# EAGLE design FeederShieldMega (EAGLE 9.6.0)
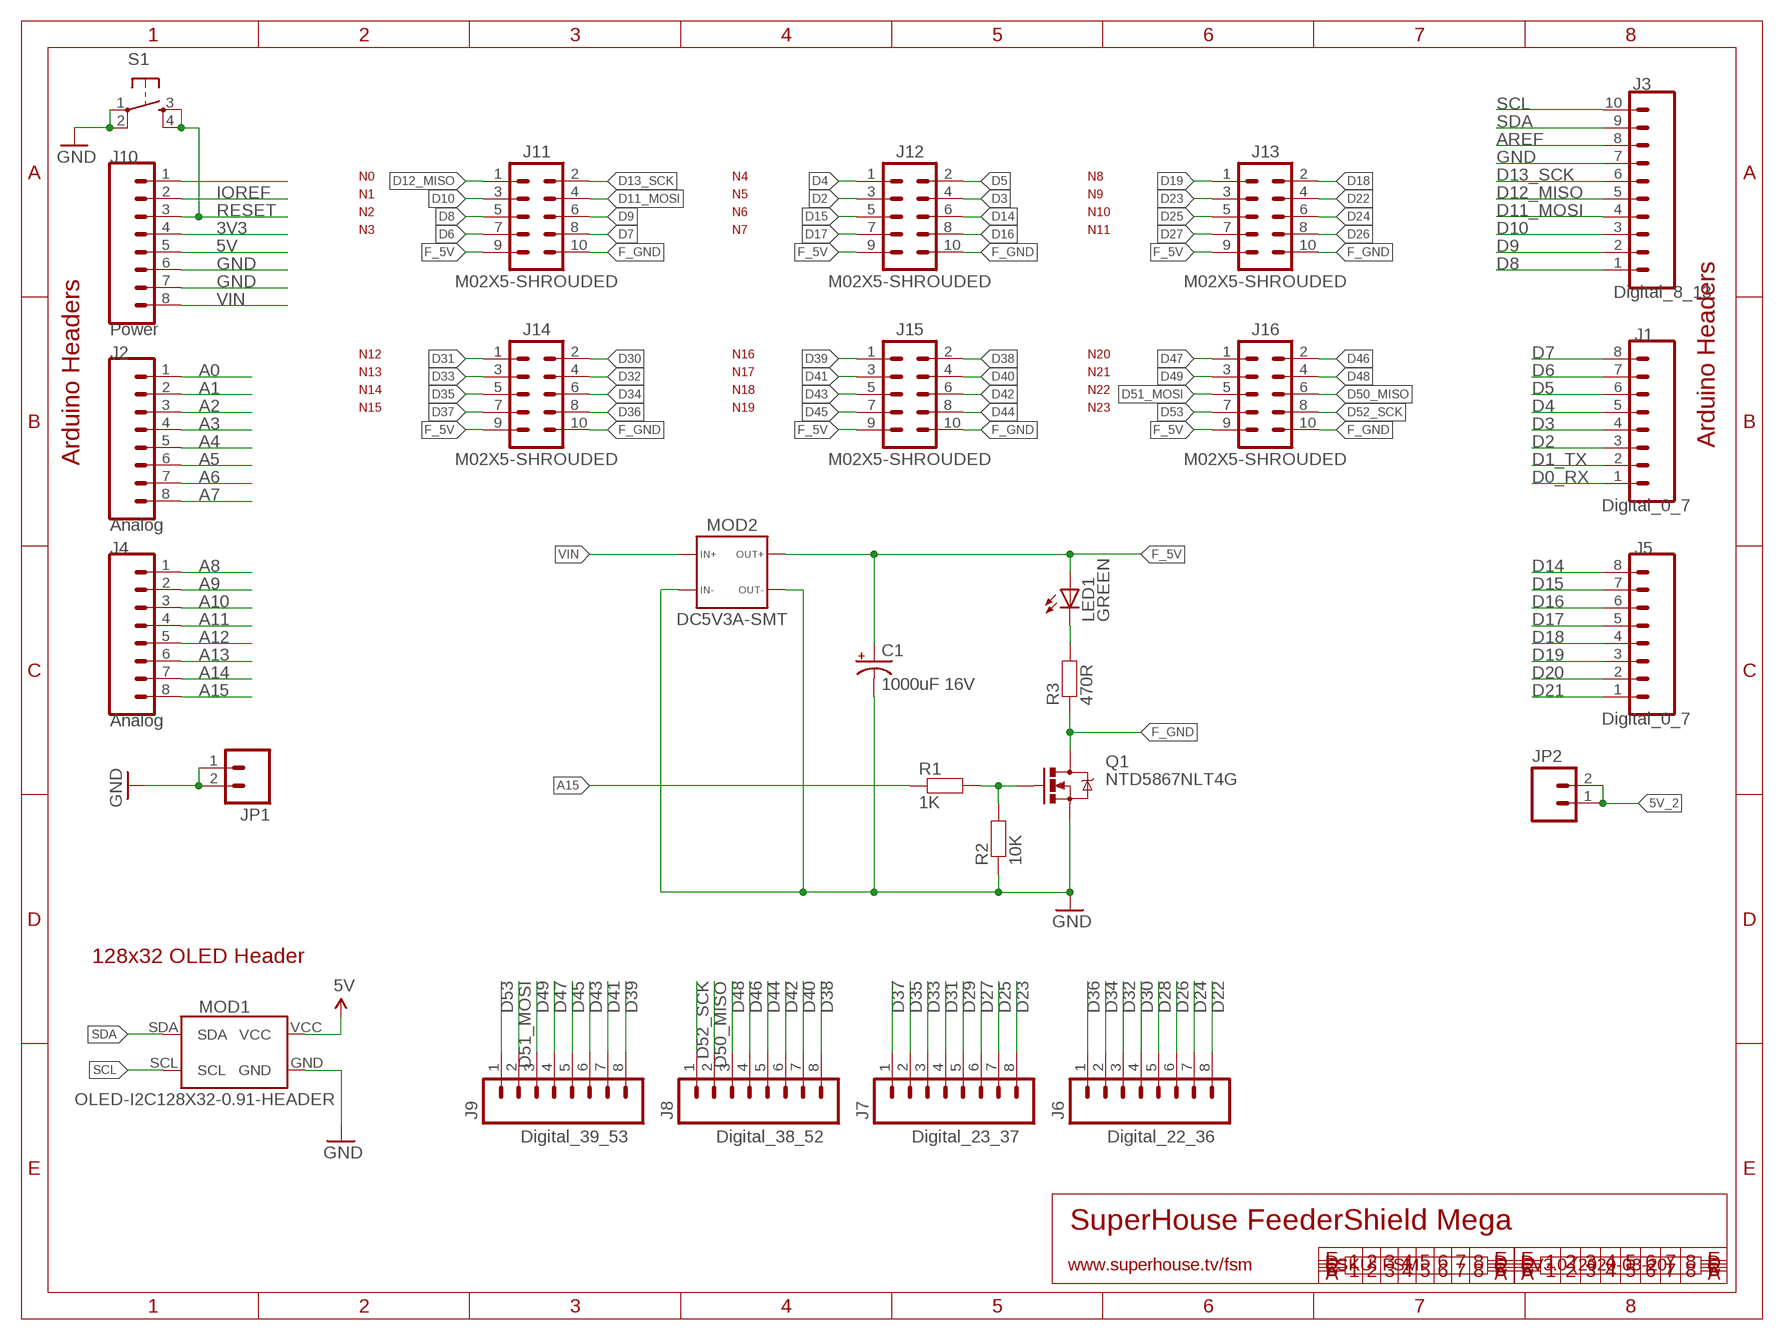
[diagram p0: schematic, sheet 1]

## Parts
C1  1000uF 16V  CAP_POL-5.08-10X18-FLAT  [CPOL-RADIAL-5.08-10X18-FLAT]
J1  Digital_0_7  M08-PIN-BELOW  [1X08-P-BELOW]
J2  Analog  M08-PIN-BELOW  [1X08-P-BELOW]
J3  Digital_8_13  M10-PIN-BELOW  [1X10-P-BELOW]
J4  Analog  M08-PIN-BELOW  [1X08-P-BELOW]
J5  Digital_0_7  M08-PIN-BELOW  [1X08-P-BELOW]
J6  Digital_22_36  M08-PIN-BELOW  [1X08-P-BELOW]
J7  Digital_23_37  M08-PIN-BELOW  [1X08-P-BELOW]
J8  Digital_38_52  M08-PIN-BELOW  [1X08-P-BELOW]
J9  Digital_39_53  M08-PIN-BELOW  [1X08-P-BELOW]
J10  Power  M08-PIN-BELOW  [1X08-P-BELOW]
J11  M02X5-SHROUDED  [2X05-2.54-SHROUDED]
J12  M02X5-SHROUDED  [2X05-2.54-SHROUDED]
J13  M02X5-SHROUDED  [2X05-2.54-SHROUDED]
J14  M02X5-SHROUDED  [2X05-2.54-SHROUDED]
J15  M02X5-SHROUDED  [2X05-2.54-SHROUDED]
J16  M02X5-SHROUDED  [2X05-2.54-SHROUDED]
JP1  M02-PIN-BELOW  [1X02-P-BELOW]
JP2  M02-PIN-BELOW  [1X02-P-BELOW]
LED1  GREEN  LED0603  [LED-0603]
MOD1  OLED-I2C128X32-0.91-HEADER  [OLED-128X32-0.91-HEADER]
MOD2  DC5V3A-SMT  [DC5V3A-SMT]
Q1  NTD5867NLT4G  MOSFET-NCHANNEL-DPAK  [DPACK]
R1  1K  RESISTOR0603  [R0603]
R2  10K  RESISTOR0603  [R0603]
R3  470R  RESISTOR0603  [R0603]
S1  TAC_SWITCH-PTH-6  [TACTILE-PTH-6MM]

## Nets
3V3: J10.4
5V: J10.5 MOD1.VCC
5V_2: JP2.1 JP2.2
A0: J2.1
A1: J2.2
A2: J2.3
A3: J2.4
A4: J2.5
A5: J2.6
A6: J2.7
A7: J2.8
A8: J4.1
A9: J4.2
A10: J4.3
A11: J4.4
A12: J4.5
A13: J4.6
A14: J4.7
A15: J4.8 R1.1
AREF: J3.8
D0_RX: J1.1
D1_TX: J1.2
D2: J1.3 J12.3
D3: J1.4 J12.4
D4: J1.5 J12.1
D5: J1.6 J12.2
D6: J1.7 J11.7
D7: J1.8 J11.8
D8: J3.1 J11.5
D9: J3.2 J11.6
D10: J3.3 J11.3
D11_MOSI: J3.4 J11.4
D12_MISO: J3.5 J11.1
D13_SCK: J3.6 J11.2
D14: J5.8 J12.6
D15: J5.7 J12.5
D16: J5.6 J12.8
D17: J5.5 J12.7
D18: J5.4 J13.2
D19: J5.3 J13.1
D20: J5.2
D21: J5.1
D22: J6.8 J13.4
D23: J7.8 J13.3
D24: J6.7 J13.6
D25: J7.7 J13.5
D26: J6.6 J13.8
D27: J7.6 J13.7
D28: J6.5
D29: J7.5
D30: J6.4 J14.2
D31: J7.4 J14.1
D32: J6.3 J14.4
D33: J7.3 J14.3
D34: J6.2 J14.6
D35: J7.2 J14.5
D36: J6.1 J14.8
D37: J7.1 J14.7
D38: J8.8 J15.2
D39: J9.8 J15.1
D40: J8.7 J15.4
D41: J9.7 J15.3
D42: J8.6 J15.6
D43: J9.6 J15.5
D44: J8.5 J15.8
D45: J9.5 J15.7
D46: J8.4 J16.2
D47: J9.4 J16.1
D48: J8.3 J16.4
D49: J9.3 J16.3
D50_MISO: J8.2 J16.6
D51_MOSI: J9.2 J16.5
D52_SCK: J8.1 J16.8
D53: J9.1 J16.7
F_5V: C1.1(+) J11.9 J12.9 J13.9 J14.9 J15.9 J16.9 LED1.A MOD2.3A MOD2.3B
F_GND: J11.10 J12.10 J13.10 J14.10 J15.10 J16.10 Q1.2(D) R3.1
GND: C1.2(-) J3.7 J10.6 J10.7 JP1.1 JP1.2 MOD1.GND MOD2.1A MOD2.1B MOD2.4A MOD2.4B Q1.3(S) R2.1 S1.1 S1.2
IOREF: J10.2
N$3: Q1.1(G) R1.2 R2.2
N$5: LED1.C R3.2
N$314: J10.1
RESET: J10.3 S1.3 S1.4
SCL: J3.10 MOD1.SCL
SDA: J3.9 MOD1.SDA
VIN: J10.8 MOD2.2A MOD2.2B

## Notes on the sheet
- N0 | N4 | N8
- N1 | N5 | N9
- N2 | N6 | N10
- N3 | N7 | N11
- N12 | N16 | N20
- N13 | N17 | N21
- N14 | N18 | N22
- N15 | N19 | N23
- Arduino Headers
- Arduino Headers
- 128x32 OLED Header
- SuperHouse FeederShield Mega
- www.superhouse.tv/fsm | SKU: FSM | V3.0 (2020-03-20)

## Library data of the parts
C1 = SuperHouse-DiscreteSemi:CAP_POL: Capacitor Polarized These are standard SMD and PTH capacitors. Normally 10uF, 47uF, and 100uF in electrolytic and tantalum varieties. Always verify the external diameter of the through hole cap, it varies with capacity, voltage, and manufacturer. The EIA devices should be standard.
J1 J2 J4-J10 = SuperHouse-Connectors:M08: 8-way header Standard 1x8 header, and screw terminal variations
J3 = SuperHouse-Connectors:M10: 10-way header Standard 1x10 header, and screw terminal variations
J11-J16 = SuperHouse-Connectors:M02X5: M10 header in 2x5 format
JP1 JP2 = SuperHouse-Connectors:M02: 2-way header Standard 1x2 header, and screw terminal variations
LED1 = SuperHouse-LEDs:LED: LEDs Standard schematic elements and footprints for 5mm, 3mm, 1206, and 0603 sized LEDs. 5mm - Spark Fun Electronics SKU : COM-00529 (and others)
MOD1 = SuperHouse-Displays:OLED-I2C: OLED module with SSD1306 I2C driver
MOD2 = SuperHouse-Regulators:DC5V3A: 5V 3A voltage regulator module from AliExpress
Q1 = SuperHouse-DiscreteSemi:MOSFET-NCHANNEL: N-channel MOSFET
R1-R3 = SuperHouse-DiscreteSemi:RESISTOR: Resistor Standard resistors.
S1 = SuperHouse-Switches:TAC_SWITCH: Momentary Switch Tactile switch, normally-open.

## Board
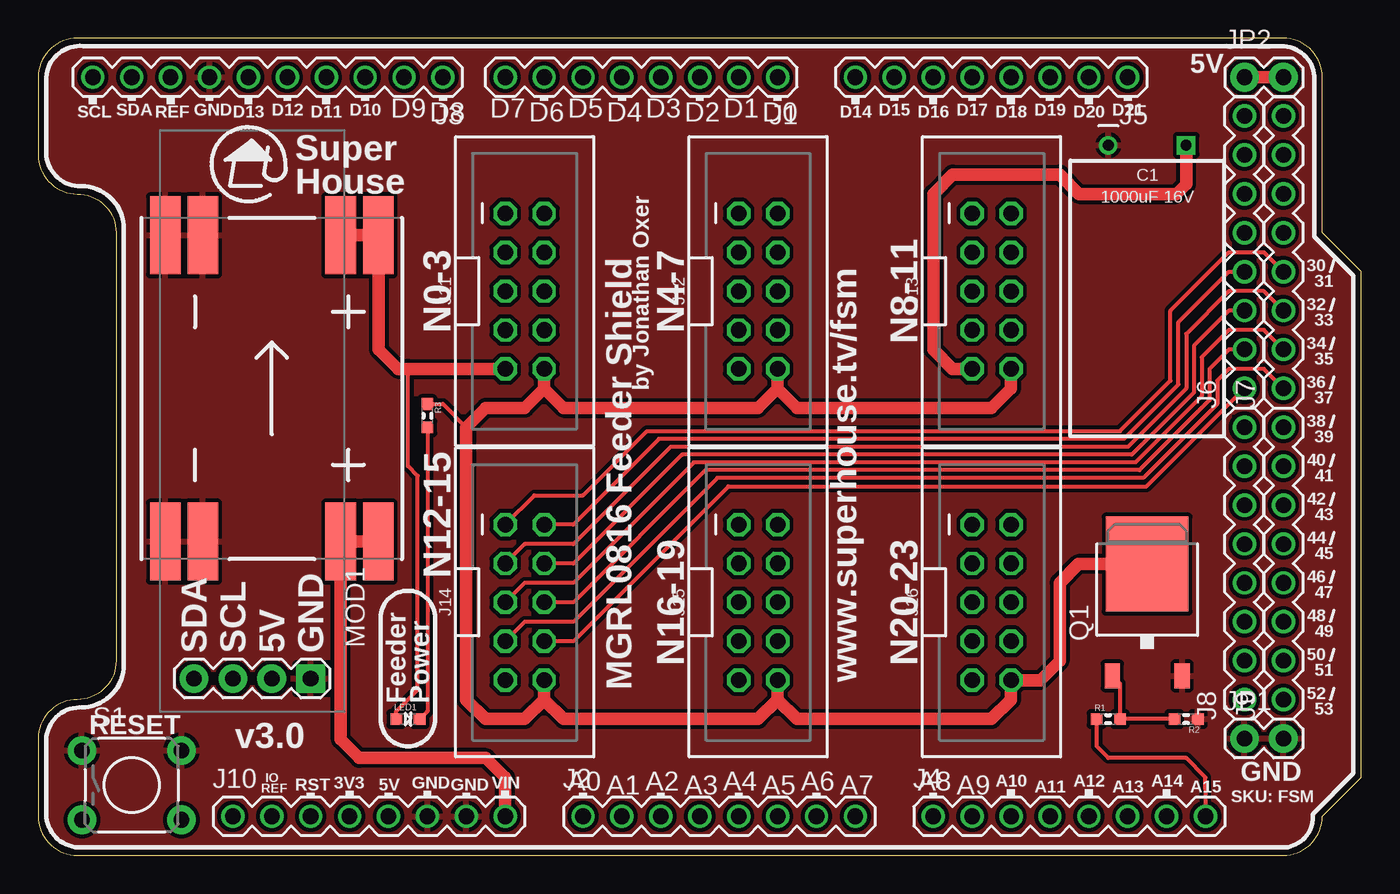
[diagram p1: board, top side]
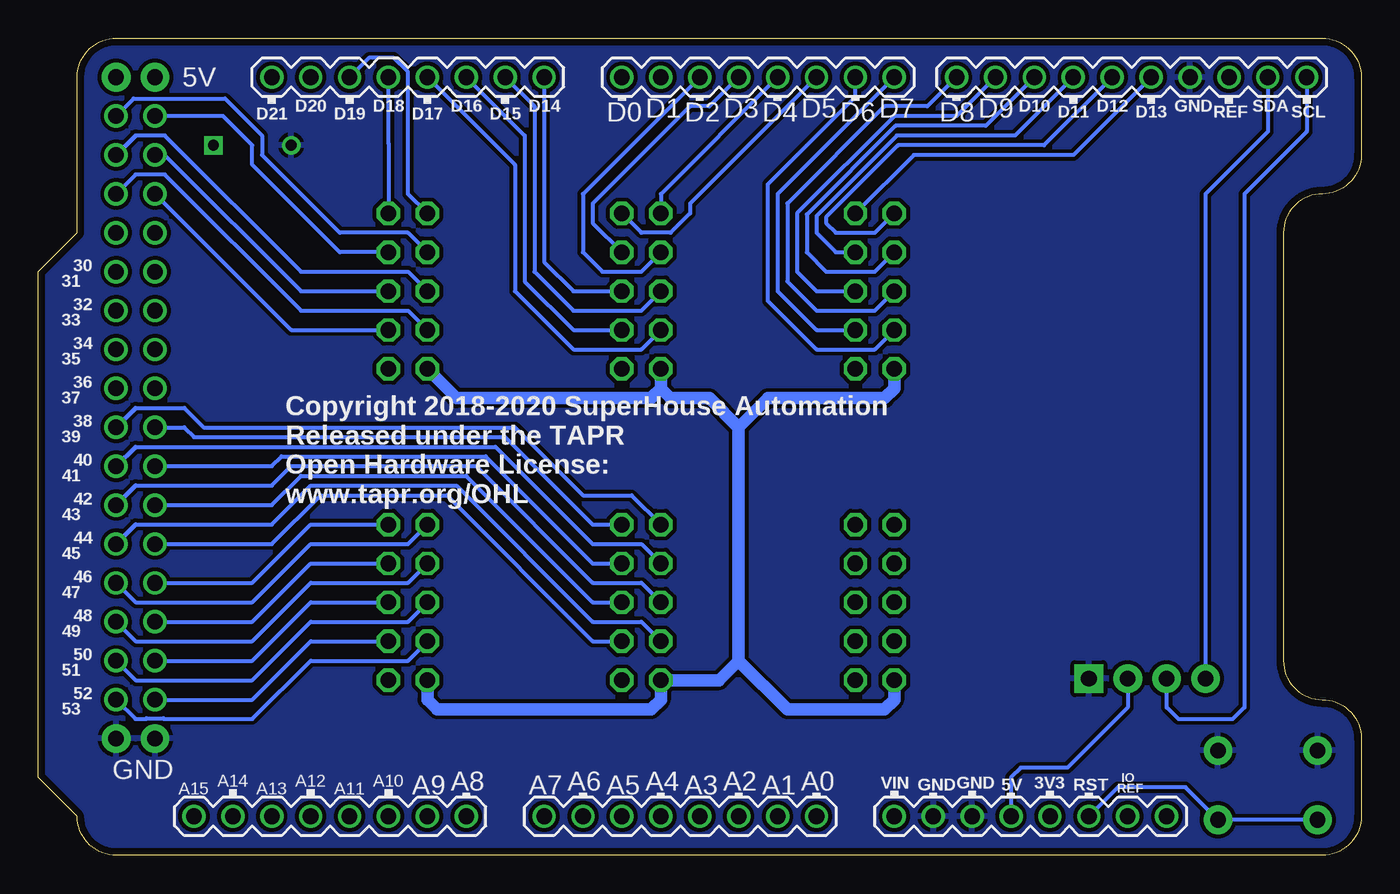
[diagram p2: board, bottom side, seen from below]

Size 86.36 x 53.34 mm. Coordinates in mm from the lower left corner, seen from the top.
Outline: 0,2.54 arc90 2.54,0 81.28,0 arc90 83.82,2.54 86.36,5.08 86.36,38.1 83.82,40.64 83.82,50.8 arc90 81.28,53.34 2.54,53.34 arc90 0,50.8 0,45.72 arc90 2.54,43.18 arc-90 5.08,40.64 5.08,12.7 arc-90 2.54,10.16 arc90 0,7.62 0,2.54
Copper layers (1*16): Top 0.035mm / dielectric 1.5mm / Bottom 0.035mm
Design rules "default *": minimum track width 10mil, minimum drill 24mil, track to track 10mil, track to pad 10mil, pad to pad 10mil, via to via 10mil, smd to smd 8mil, copper to edge 18mil, drill to drill 8mil, minimum pad ring 10mil, minimum via ring 8mil, stop-mask expansion 4mil, vias tented up to drill 0mil, thermal gap 10mil

### Footprints (pad centres in the part's own frame; a part is rotated, then mirrored left to right if it is on the bottom)
CPOL-RADIAL-5.08-10X18-FLAT = drill 0.7 square: 1 2.54,0 | drill 0.7: 2 -2.54,0
1X08-P-BELOW = drill 1.016: 1 0,0; 2 2.54,0; 3 5.08,0; 4 7.62,0; 5 10.16,0; 6 12.7,0; 7 15.24,0; 8 17.78,0
1X10-P-BELOW = drill 1.016: 1 0,0; 2 2.54,0; 3 5.08,0; 4 7.62,0; 5 10.16,0; 6 12.7,0; 7 15.24,0; 8 17.78,0; 9 20.32,0; 10 22.86,0
2X05-2.54-SHROUDED = drill 1.016 octagon: 1 -5.08,-1.27; 2 -5.08,1.27; 3 -2.54,-1.27; 4 -2.54,1.27; 5 0,-1.27; 6 0,1.27; 7 2.54,-1.27; 8 2.54,1.27; 9 5.08,-1.27; 10 5.08,1.27
1X02-P-BELOW = drill 1.016 pad 1.88: 1 0,0; 2 2.54,0
LED-0603 = smd 0.762 x 0.762: A -0.762,0; C 0.762,0
OLED-128X32-0.91-HEADER = drill 1.016 pad 1.88 square: GND -18.31,-3.81 | drill 1.016 pad 1.88: SCL -18.31,1.27; SDA -18.31,3.81; VCC -18.31,-1.27
DC5V3A-SMT = smd 5.08 x 2: 1A -10,6.95; 1B -10,4.5; 2A -10,-4.5; 2B -10,-6.95; 3A 10,-4.5; 3B 10,-6.95; 4A 10,6.95; 4B 10,4.5
DPACK = smd 1 x 1.6: 1 -2.28,-4.8; 3 2.28,-4.8 | smd 5.4 x 6.2: 2 0,2.5
R0603 = smd 0.762 x 0.762: 1 -0.762,0; 2 0.762,0
TACTILE-PTH-6MM = drill 1.016 pad 1.88: 1 -3.251,2.261; 2 3.251,2.261; 3 -3.251,-2.261; 4 3.251,-2.261

### Placement (x,y rotation side)
C1  72.39,46.35 0 top
J1  48.26,50.8 180 top
J2  35.56,2.54 0 top
J3  26.42,50.8 180 top
J4  58.42,2.54 0 top
J5  71.12,50.8 180 top
J6  78.74,30.48 90 top
J7  81.28,30.48 90 top
J8  78.74,10.16 90 top
J9  81.28,10.16 90 top
J10  12.7,2.54 0 top
J11  31.75,36.83 270 top
J12  46.99,36.83 270 top
J13  62.23,36.83 270 top
J14  31.75,16.51 270 top
J15  46.99,16.51 270 top
J16  62.23,16.51 270 top
JP1  78.74,7.62 0 top
JP2  78.74,50.8 0 top
LED1  24.13,8.89 0 top
MOD1  13.97,29.84 90 top
MOD2  15.24,30.48 90 top
Q1  72.39,16.51 0 top
R1  69.85,8.89 0 top
R2  74.93,8.89 180 top
R3  25.4,28.7 270 top
S1  6.1,4.57 0 top

### Tracks (layer width: path | path; a pad name or v marks a point on that pad's centre or on a via)
5V
  Bottom 0.254: MOD1.VCC 15.24,9.65 19.18,5.71 22.23,5.71 22.86,5.08 J10.5
5V_2
  Top 0.813: JP2.2 JP2.1
A15
  Top 0.254: J4.8 76.2,3.81 76.2,4.32 76.2,5.08 74.93,6.35 69.85,6.35 69.09,7.11 R1.1
D2
  Bottom 0.254: J1.3 50.8,43.18 50.8,39.37 49.53,38.1 46.99,38.1 J12.3
D3
  Bottom 0.254: J1.4 42.55,48.9 43.81,48.9 50.16,42.55 50.16,41.27 J12.4
D4
  Bottom 0.254: J1.5 45.72,43.18 J12.1
D5
  Bottom 0.254: J1.6 43.81,42.55 43.81,41.91 45.09,40.64 46.99,40.64 J12.2
D6
  Bottom 0.254: J11.7 31.75,33.02 35.56,33.02 38.73,36.2 38.73,43.81 33.02,49.53 J1.7
D7
  Bottom 0.254: J1.8 38.1,43.18 38.1,36.83 35.56,34.29 J11.8
D8
  Bottom 0.254: J3.1 28.32,48.9 31.11,48.9 37.47,42.55 37.47,37.47 35.56,35.56 31.75,35.56 J11.5
D9
  Bottom 0.254: J3.2 26.42,48.26 30.48,48.26 36.83,41.91 36.83,38.1 35.56,36.83 J11.6
D10
  Bottom 0.254: J3.3 24.51,47.62 30.4,47.62 36.2,41.83 36.2,39.37 34.92,38.1 31.75,38.1 J11.3
D11_MOSI
  Bottom 0.254: J3.4 22.61,46.99 30.31,46.99 35.56,41.74 35.56,40.64 34.29,39.37 J11.4
D12_MISO
  Bottom 0.254: J3.5 20.7,46.35 30.23,46.35 34.92,41.66 34.92,41.27 34.29,40.64 31.75,40.64 J11.1
D13_SCK
  Bottom 0.254: J3.6 18.8,45.72 29.21,45.72 J11.2
D14
  Bottom 0.254: J5.8 53.34,38.73 51.44,36.83 J12.6
D15
  Bottom 0.254: J5.7 53.98,48.9 53.98,38.1 51.44,35.56 46.99,35.56 J12.5
D16
  Bottom 0.254: J12.8 51.44,34.29 54.61,37.47 54.61,46.99 J5.6
D17
  Bottom 0.254: J5.5 55.24,45.09 55.24,36.83 51.44,33.02 46.99,33.02 J12.7
D18
  Bottom 0.254: J5.4 63.5,46.99 63.5,46.48 J13.2
D19
  Bottom 0.254: J5.3 64.77,52.07 63.15,52.07 62.23,51.15 62.23,43.18 J13.1
D22
  Bottom 0.254: J13.4 66.67,39.37 72.39,45.09 72.39,46.35 74.3,48.26 J6.8
D23
  Bottom 0.254: J13.3 62.23,40.64 66.67,40.64 71.75,45.72 71.75,46.99 74.17,49.4 80.14,49.4 J7.8
D24
  Bottom 0.254: J13.6 69.22,36.83 78.11,45.72 J6.7
D25
  Bottom 0.254: 80.01,46.99 78.11,46.99 69.22,38.1 62.23,38.1 J13.5
  Bottom 0.305: 80.01,46.99 J7.7
D26
  Bottom 0.254: J13.8 69.85,34.29 J6.6
D27
  Bottom 0.254: J7.6 80.01,44.45 78.11,44.45 69.22,35.56 62.23,35.56 J13.7
D30
  Top 0.254: J6.4 77.72,38.1 74.42,34.8 74.42,30.73 70.87,27.18 40.51,27.18 34.92,21.59 J14.2
D31
  Top 0.254: J7.4 80.01,39.37 77.72,39.37 73.91,35.56 73.91,30.99 70.61,27.69 39.75,27.69 35.56,23.5 32.38,23.5 J14.1
D32
  Top 0.254: J6.3 77.72,35.56 75.44,33.27 75.44,30.23 71.37,26.16 42.04,26.16 34.92,19.05 J14.4
D33
  Top 0.254: J7.3 80.01,36.83 77.72,36.83 74.93,34.04 74.93,30.48 71.12,26.67 41.27,26.67 34.92,20.32 31.75,20.32 J14.3
D34
  Top 0.254: J6.2 77.72,33.02 76.45,31.75 76.45,29.72 71.88,25.15 43.56,25.15 34.92,16.51 J14.6
D35
  Top 0.254: J7.2 80.01,34.29 77.72,34.29 75.95,32.51 75.95,29.97 71.63,25.65 42.8,25.65 34.92,17.78 31.75,17.78 J14.5
D36
  Top 0.254: J14.8 34.92,13.97 45.04,24.09 72.35,24.09 J6.1
D37
  Top 0.254: J7.1 80.01,31.75 77.72,31.75 76.96,30.99 76.96,29.46 72.14,24.64 44.32,24.64 34.92,15.24 31.75,15.24 J14.7
D38
  Bottom 0.254: J15.2 50.16,21.59 55.88,27.3 76.2,27.3 76.83,27.94 J8.8
D39
  Bottom 0.254: 80.01,29.21 76.83,29.21 75.56,27.94 55.24,27.94 50.8,23.5 47.62,23.5 J15.1
  Bottom 0.305: J9.8 80.01,29.21
D40
  Bottom 0.254: J8.7 71.12,25.4 70.48,26.04 57.15,26.04 50.16,19.05 J15.4
D41
  Bottom 0.254: 80.01,26.67 56.52,26.67 50.16,20.32 46.99,20.32 J15.3
  Bottom 0.305: 80.01,26.67 J9.7
D42
  Bottom 0.254: J15.6 50.16,16.51 58.42,24.77 69.22,24.77 71.12,22.86 J8.6
D43
  Bottom 0.254: J15.5 46.99,17.78 50.16,17.78 57.78,25.4 69.85,25.4 71.12,24.13 80.01,24.13
  Bottom 0.305: J9.6 80.01,24.13
D44
  Bottom 0.254: J8.5 71.12,20.32 67.94,23.5 59.69,23.5 50.16,13.97 J15.8
D45
  Bottom 0.254: J15.7 46.99,15.24 50.16,15.24 59.05,24.13 68.58,24.13 71.12,21.59 80.01,21.59
  Bottom 0.305: J9.5 80.01,21.59
D46
  Bottom 0.254: J16.2 68.58,21.59 72.39,17.78 J8.4
D47
  Bottom 0.254: J9.4 80.01,16.51 72.39,16.51 68.58,20.32 62.23,20.32 J16.1
D48
  Bottom 0.254: J16.4 68.58,19.05 72.39,15.24 J8.3
D49
  Bottom 0.254: J9.3 80.01,13.97 72.39,13.97 68.58,17.78 62.23,17.78 J16.3
D50_MISO
  Bottom 0.254: J16.6 68.58,16.51 72.39,12.7 J8.2
D51_MOSI
  Bottom 0.254: J9.2 80.01,11.43 72.39,11.43 68.58,15.24 62.23,15.24 J16.5
D52_SCK
  Bottom 0.254: J16.8 68.58,13.97 72.39,10.16 J8.1
D53
  Bottom 0.254: J9.1 80.01,8.89 79.34,8.89 79.29,8.94 78.19,8.94 78.14,8.89 72.39,8.89 68.58,12.7 62.23,12.7 J16.7
F_5V
  Top 0.254: LED1.A 23.37,9.4 24.77,10.79 24.77,24.77 24.13,25.4 24.13,31.75
  Top 0.813: MOD2.3A MOD2.3B 22.23,40.45 22.23,33.02 23.5,31.75 24.13,31.75 J11.9 | J13.9 59.69,31.75 58.42,33.02 58.42,43.18 59.69,44.45 66.67,44.45 67.94,43.18 74.3,43.18 74.93,43.81 C1.1
  Bottom 0.813: J14.9 30.48,10.16 31.11,9.53 37.47,9.53 40.64,12.7 | J16.9 60.96,10.16 60.33,9.53 46.35,9.53 45.72,10.16 J15.9 41.91,11.43 40.64,12.7 | J12.9 45.72,30.48 | J13.9 59.05,29.84 46.35,29.84 45.72,30.48 | 45.72,30.48 45.09,29.84 42.55,29.84 40.64,27.94 | 40.64,27.94 40.64,12.7 | 40.64,27.94 38.73,29.84 31.11,29.84 30.48,30.48 J11.9
F_GND
  Top 0.254: R3.1 26.42,29.46 27.94,27.94
  Top 0.813: Q1.2 67.91,19.01 66.67,17.78 66.67,12.7 65.41,11.43 J16.10 63.5,10.16 62.23,8.89 49.53,8.89 48.26,10.16 | J15.10 48.26,10.16 | J14.10 33.02,10.16 | 33.02,10.16 34.29,8.89 46.99,8.89 48.26,10.16 | J13.10 63.5,30.48 62.23,29.21 49.53,29.21 48.26,30.48 | J12.10 48.26,30.48 | J11.10 33.02,30.48 | 33.02,30.48 34.29,29.21 46.99,29.21 48.26,30.48 | 33.02,30.48 31.75,29.21 29.21,29.21 27.94,27.94 27.94,10.16 29.21,8.89 31.75,8.89 33.02,10.16
GND
  pour Bottom: 0,50.8 arc-74 2.54,53.34 81.28,53.34 arc-74 83.82,50.8 83.82,40.64 86.36,38.1 86.36,5.08 83.82,2.54 arc-74 81.28,0 1.27,0 arc-74 0,2.54 0,7.62 arc-90 2.54,10.16 arc90 5.08,12.7 5.08,40.64 arc90 2.54,43.18 arc-90 0,45.72
  pour Top: 0,50.8 arc-74 2.54,53.34 81.28,53.34 arc-74 83.82,50.8 83.82,40.64 86.36,38.1 86.36,5.08 83.82,2.54 arc-74 81.28,0 1.27,0 arc-74 0,2.54 0,7.62 arc-90 2.54,10.16 arc90 5.08,12.7 5.08,40.64 arc90 2.54,43.18 arc-90 0,45.72
N$3
  Top 0.254: R2.2 R1.2 70.61,11.21 Q1.1
N$5
  Top 0.254: LED1.C 25.4,9.4 R3.2
RESET
  Bottom 0.254: J10.3 15.88,4.45 11.48,4.45 S1.4 S1.3
SCL
  Bottom 0.254: J3.10 3.56,47.24 7.62,43.18 7.62,9.65 8.38,8.89 11.94,8.89 12.7,9.65 MOD1.SCL
SDA
  Bottom 0.254: J3.9 6.1,47.24 10.16,43.18 MOD1.SDA
VIN
  Top 0.813: MOD2.2B MOD2.2A 19.74,7.57 20.95,6.35 29.21,6.35 30.48,5.08 J10.8

### Text on the board
tPlace: 5V | SCL | SDA | REF | GND | D13 | D12 | D11 | D10 | D9 | D8 | D7 | D6 | D5 | D4 | D3 | D2 | D1 | D0 | D14 | D15 | D16 | D17 | D18 | D19 | D20 | D21 | Super / House | 30 | N0-3 | N4-7 | N8-11 | 31 | 32 | 33 | 34 | 35 | by Jonathan Oxer | 36 | 37 | 38 | 39 | 40 | 41 | 42 | N12-15 | 43 | 44 | 45 | 46 | N16-19 | N20-23 | 47 | 48 | 49 | SDA | SCL | 5V | GND | 50 | 51 | MGRL0816 Feeder Shield | www.superhouse.tv/fsm | Feeder / Power | 52 | 53 | RESET | v3.0 | IO | GND | REF | RST | 3V3 | 5V | GND | GND | VIN | A0 | A1 | A2 | A3 | A4 | A5 | A6 | A7 | A8 | A9 | A10 | A11 | A12 | A13 | A14 | A15 | SKU: FSM
bPlace: 5V | SDA | GND | D12 | D10 | D14 | D16 | D18 | D20 | SCL | REF | D13 | D11 | D9 | D8 | D7 | D6 | D5 | D4 | D3 | D2 | D1 | D0 | D15 | D17 | D19 | D21 | 30 | 31 | 32 | 33 | 34 | 35 | 36 | 37 | 38 | 39 | 40 | 41 | Copyright 2018-2020 SuperHouse Automation / Released under the TAPR / Open Hardware License: / www.tapr.org/OHL | 42 | 43 | 44 | 45 | 46 | 47 | 48 | 49 | 50 | 51 | 52 | 53 | IO | GND | REF | RST | 3V3 | 5V | GND | GND | VIN | A0 | A1 | A2 | A3 | A4 | A5 | A6 | A7 | A8 | A9 | A10 | A11 | A12 | A13 | A14 | A15